# EAGLE design StickIt-Buttons (EAGLE 5.11)
AUTHOR: Dave Vandenbout / XESS Corp.; DIGIKEY#: 742C083472JPCT-ND; MANF#: 742C083472JPTR; MOUSER#: 774-742C083472JP; VERSION#: 2.0
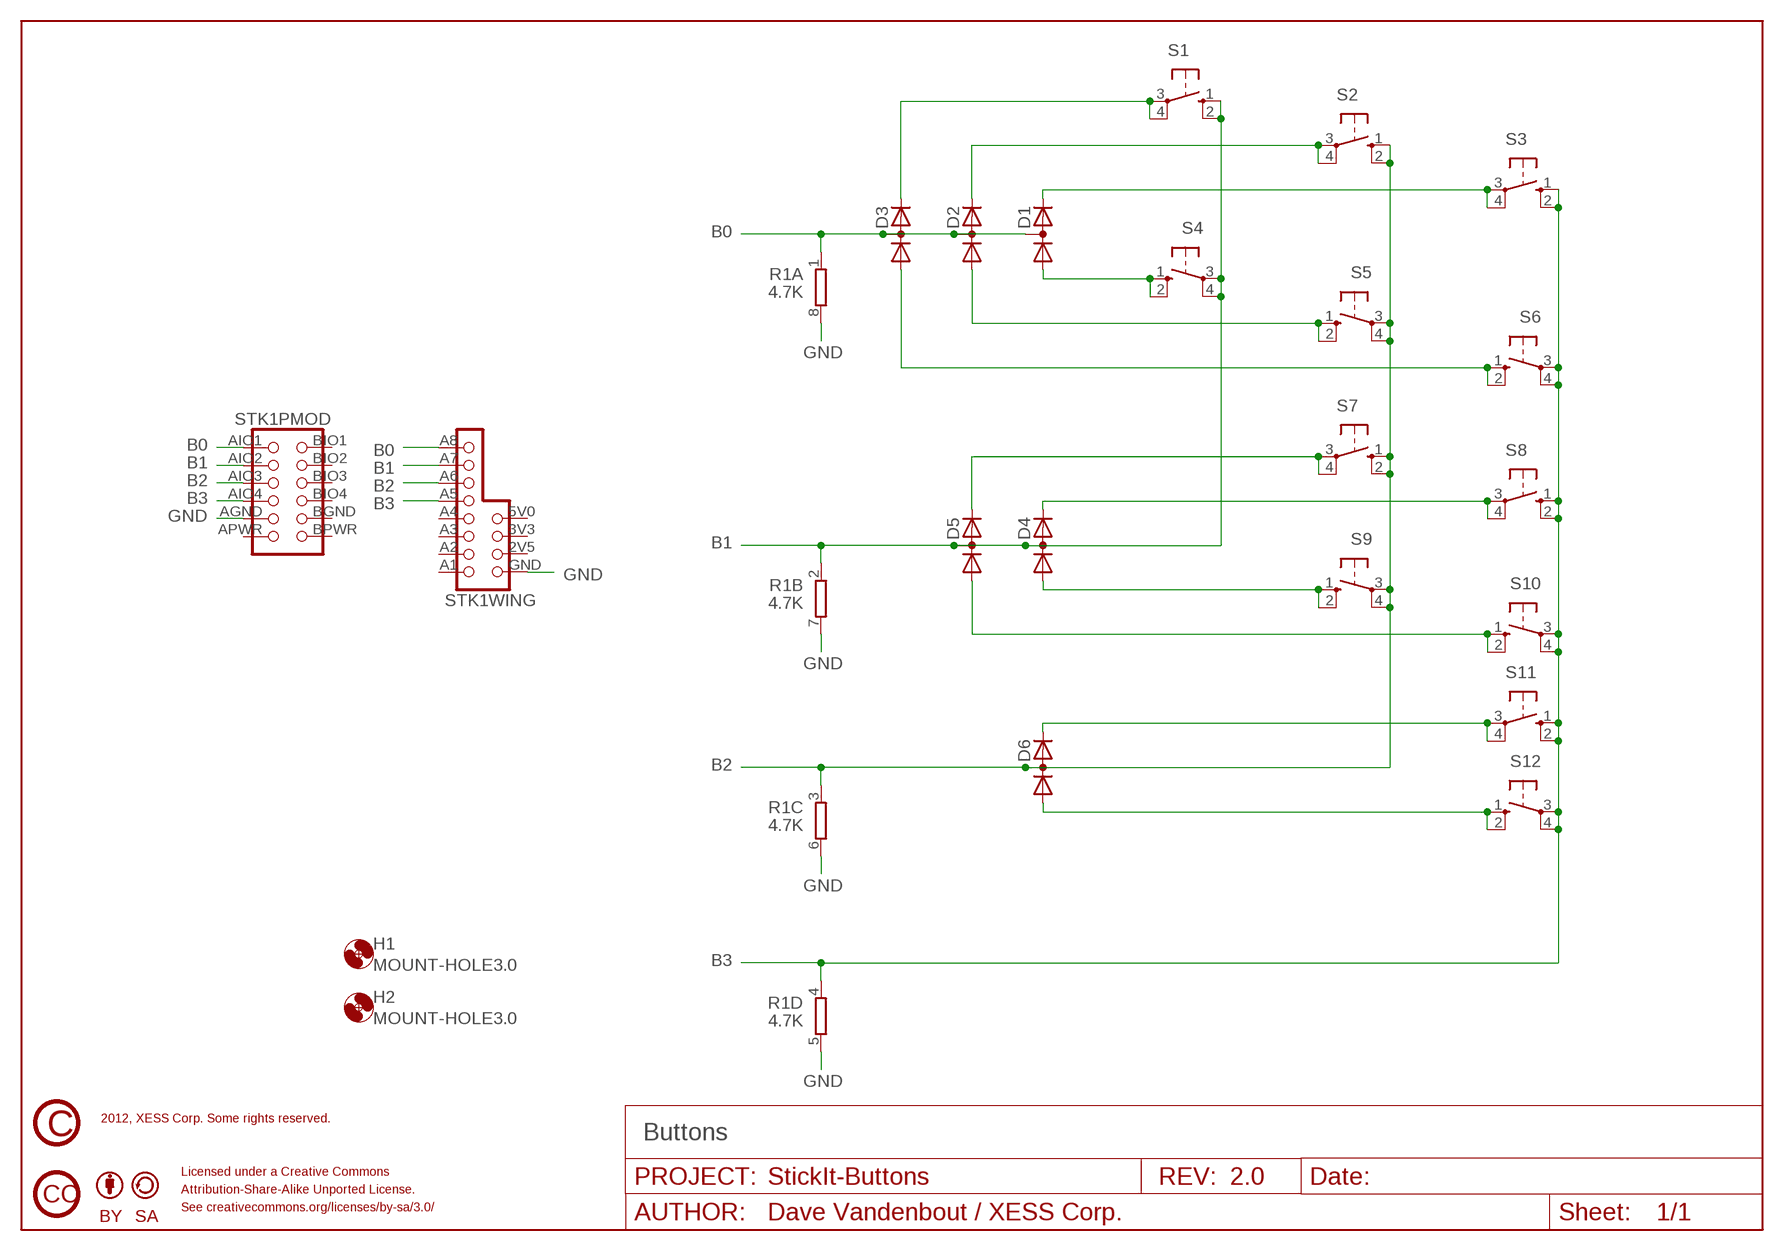
[diagram p0: schematic, sheet 1]

## Parts
D1  DIODE_AC-AC  [SC-70]
D2  DIODE_AC-AC  [SC-70]
D3  DIODE_AC-AC  [SC-70]
D4  DIODE_AC-AC  [SC-70]
D5  DIODE_AC-AC  [SC-70]
D6  DIODE_AC-AC  [SC-70]
H1  MOUNT-HOLE3.0  [3,0]
H2  MOUNT-HOLE3.0  [3,0]
R1  4.7K  RES4742  [742C083]
S1  10-XX  [B3F-10XX]
S2  10-XX  [B3F-10XX]
S3  10-XX  [B3F-10XX]
S4  10-XX  [B3F-10XX]
S5  10-XX  [B3F-10XX]
S6  10-XX  [B3F-10XX]
S7  10-XX  [B3F-10XX]
S8  10-XX  [B3F-10XX]
S9  10-XX  [B3F-10XX]
S10  10-XX  [B3F-10XX]
S11  10-XX  [B3F-10XX]
S12  10-XX  [B3F-10XX]
STK1  STICKIT-HEADER1  [STICKIT-HEADER1]
U$2  CC_CC  [CC_CC]
U$3  CC_BY  [CC_BY]
U$4  CC_SA  [CC_SA]
U$5  CC_COPYRIGHT  [CC_COPYRIGHT]

## Nets
B0: D1.3(AK) D2.3(AK) D3.3(AK) R1.1 STK1.A8(WING:A8) STK1.AIO1(PMOD:AIO1)
B1: D4.3(AK) D5.3(AK) R1.2 S1.1(S) S1.2(S1) S4.3(P) S4.4(P1) STK1.A7(WING:A7) STK1.AIO2(PMOD:AIO2)
B01: D3.2(K) S1.3(P) S1.4(P1)
B2: D6.3(AK) R1.3 S2.1(S) S2.2(S1) S5.3(P) S5.4(P1) S7.1(S) S7.2(S1) S9.3(P) S9.4(P1) STK1.A6(WING:A6) STK1.AIO3(PMOD:AIO3)
B02: D2.2(K) S2.3(P) S2.4(P1)
B3: R1.4 S3.1(S) S3.2(S1) S6.3(P) S6.4(P1) S8.1(S) S8.2(S1) S10.3(P) S10.4(P1) S11.1(S) S11.2(S1) S12.3(P) S12.4(P1) STK1.A5(WING:A5) STK1.AIO4(PMOD:AIO4)
B03: D1.2(K) S3.3(P) S3.4(P1)
B10: D1.1(A) S4.1(S) S4.2(S1)
B12: D5.2(K) S7.3(P) S7.4(P1)
B13: D4.2(K) S8.3(P) S8.4(P1)
B20: D2.1(A) S5.1(S) S5.2(S1)
B21: D4.1(A) S9.1(S) S9.2(S1)
B23: D6.2(K) S11.3(P) S11.4(P1)
B30: D3.1(A) S6.1(S) S6.2(S1)
B31: D5.1(A) S10.1(S) S10.2(S1)
B32: D6.1(A) S12.1(S) S12.2(S1)
GND: R1.5 R1.6 R1.7 R1.8 STK1.AGND(PMOD:AGND) STK1.GND(WING:GND)
Unconnected: STK1.2V5(WING:2V5) STK1.3V3(WING:3V3) STK1.5V0(WING:5V) STK1.A1(WING:A1) STK1.A2(WING:A2) STK1.A3(WING:A3) STK1.A4(WING:A4) STK1.APWR(PMOD:APWR) STK1.BGND(PMOD:BGND) STK1.BIO1(PMOD:BIO1) STK1.BIO2(PMOD:BIO2) STK1.BIO3(PMOD:BIO3) STK1.BIO4(PMOD:BIO4) STK1.BPWR(PMOD:BPWR)

## Notes on the sheet
- 2012, XESS Corp. Some rights reserved.
- Buttons
- Licensed under a Creative Commons
- Attribution-Share-Alike Unported License.
- See creativecommons.org/licenses/by-sa/3.0/

## Library data of the parts
D1-D6 = xess:DIODE_AC-AC: Dual diode protects against positive & negative transients.; DIGIKEY#: BAV99WT1GOSCT-ND; MANF: ON Semiconductor; MANF#: BAV99WT1G; MOUSER#: 863-BAV99WT1G
H1 H2 = holes:MOUNT-HOLE: MOUNTING HOLE with drill center marker
R1 = xess:RES4: Resistor 4-pack Package of four resistors.; DIGIKEY#: 742C083???JPCT-ND; MANF: CTS Resistor Products; MANF#: 742C083???JPTR; MOUSER#: 774-742C083???JP
S1-S12 = xess:10-XX: OMRON SWITCH; DIGIKEY#: SW400-ND; MANF: Omron Electronics; MANF#: B3F-1000; MOUSER#: 653-B3F-1000
STK1 = xess:STICKIT-HEADER: StickIt Header Combined PMOD and Papilio Wing header for use on StickIt add-on boards.
U$2 = xess:CC_CC
U$3 = xess:CC_BY
U$4 = xess:CC_SA
U$5 = xess:CC_COPYRIGHT

## Net classes
1 power: clearance 0.254 mm

## Board
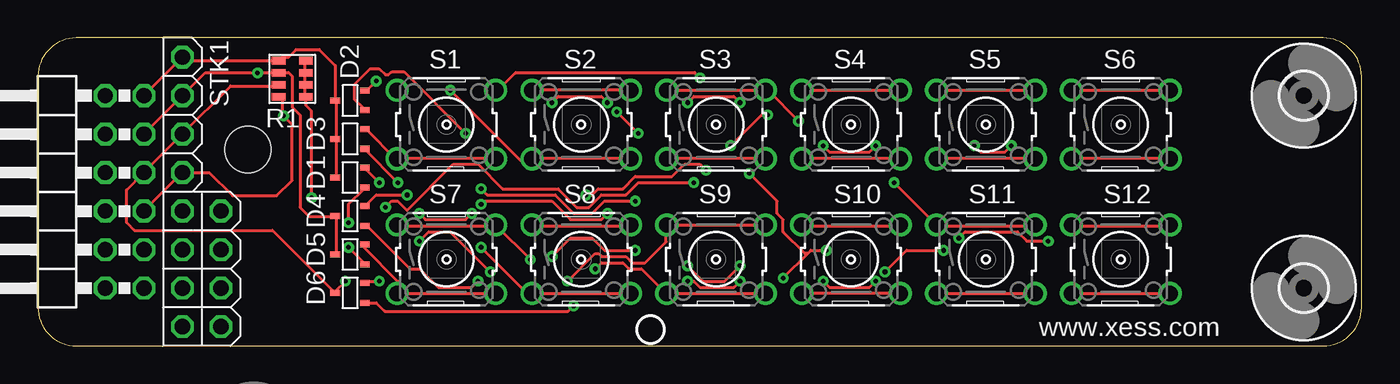
[diagram p1: board, top side]
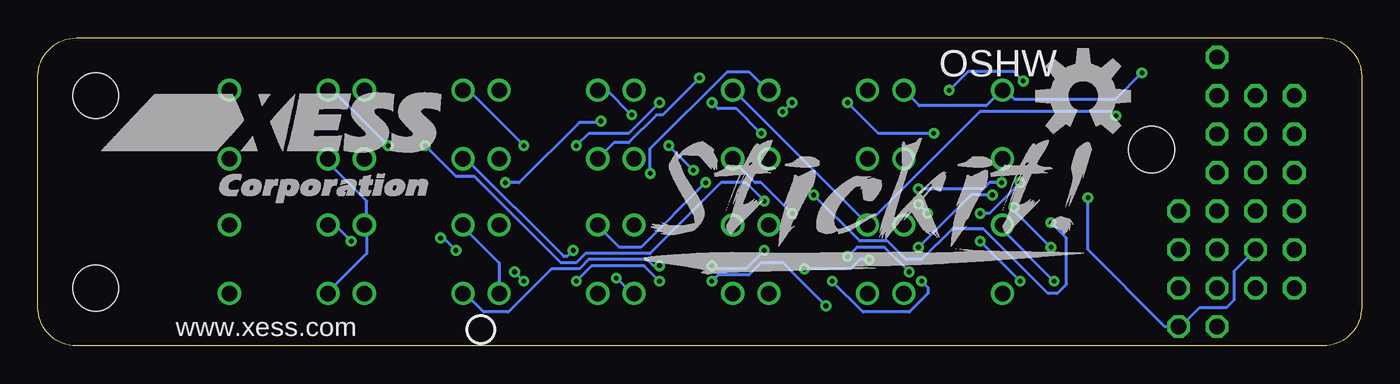
[diagram p2: board, bottom side, seen from below]

Size 87.25 x 20.32 mm. Coordinates in mm from the lower left corner, seen from the top.
Outline: 2.54,0 84.71,0 arc90 87.25,2.54 87.25,17.78 arc90 84.71,20.32 2.54,20.32 arc90 0,17.78 0,2.54 arc90 2.54,0
Copper layers (1*16): Top 0.035mm / dielectric 1.5mm / Bottom 0.035mm
Design rules "ITeadstudio_safe": minimum track width 8mil, minimum drill 12mil, track to track 8mil, track to pad 8mil, pad to pad 8mil, via to via 8mil, smd to smd 0mil, copper to edge 10mil, drill to drill 10mil, minimum pad ring 10mil, minimum via ring 8mil, stop-mask expansion 2mil, vias tented up to drill 100mil, thermal gap 10mil
tRestrict: area 18.7,0 to 87.2,20.3
bRestrict: area 18.7,0 to 87.2,20.3

### Footprints (pad centres in the part's own frame; a part is rotated, then mirrored left to right if it is on the bottom)
SC-70 = smd 0.4 x 0.65: 1 -0.65,-0.975; 2 0.65,-0.975; 3 0,0.975
3,0 = hole 3: 0,0
742C083 = smd 0.5 x 0.9: 1 -0.4,-0.9; 2 0.4,-0.9; 3 1.2,-0.9; 4 2,-0.9; 5 2,0.9; 6 1.2,0.9; 7 0.4,0.9; 8 -0.4,0.9
B3F-10XX = drill 1.016 round: 1 -3.251,2.261; 2 3.251,2.261; 3 -3.251,-2.261; 4 3.251,-2.261
STICKIT-HEADER1 = drill 1 octagon: 2V5 5.08,-15.24; 3V3 5.08,-12.7; 5V0 5.08,-10.16; A1 2.54,-17.78; A2 2.54,-15.24; A3 2.54,-12.7; A4 2.54,-10.16; A5 2.54,-7.62; A6 2.54,-5.08; A7 2.54,-2.54; A8 2.54,0; AGND 0,-12.7; AIO1 0,-2.54; AIO2 0,-5.08; AIO3 0,-7.62; AIO4 0,-10.16; APWR 0,-15.24; BGND -2.54,-12.7; BIO1 -2.54,-2.54; BIO2 -2.54,-5.08; BIO3 -2.54,-7.62; BIO4 -2.54,-10.16; BPWR -2.54,-15.24; GND 5.08,-17.78 | hole 3.048: 6.858,-6.096

### Placement (x,y rotation side)
D1  20.57,11.11 90 top
D2  20.57,16.19 90 top
D3  20.57,13.65 90 top
D4  20.57,8.57 90 top
D5  20.57,6.03 90 top
D6  20.57,3.49 90 top
H1  83.44,3.81 0 top
H2  83.44,16.51 0 top
R1  16.76,18.41 270 top
S1  26.92,14.61 0 top
S2  35.81,14.61 0 top
S3  44.7,14.61 0 top
S4  53.59,14.61 0 top
S5  62.48,14.61 0 top
S6  71.37,14.61 0 top
S7  26.92,5.71 0 top
S8  35.81,5.71 0 top
S9  44.7,5.71 0 top
S10  53.59,5.71 0 top
S11  62.48,5.71 0 top
S12  71.37,5.71 0 top
STK1  6.99,19.05 0 top
U$2  14.22,-14.61 0 top  (outside the outline)
U$3  21.21,-13.34 0 top  (outside the outline)
U$4  26.29,-13.34 0 top  (outside the outline)
U$5  14.22,-5.71 0 top  (outside the outline)

### Tracks (layer width: path | path; a pad name or v marks a point on that pad's centre or on a via)
B0
  Top 0.203: D1.3 19.66,11.18 19.66,13.61 D3.3 19.66,13.82 19.66,16.05 D2.3 | D2.3 19.66,16.26 | D2.3 19.6,18.5 18.54,19.56 17.02,19.56 16.51,19.05 16.1,19.05 R1.1 9.76,18.82 STK1.A8 STK1.AIO1
B1  (via drill 0.3)
  Top 0.203: S4.3 50.34,12.39 56.84,12.39 S4.4 | 19.66,8.53 19.66,6.1 D5.3 | 19.66,8.53 D4.3 | STK1.AIO2 STK1.A7 11.03,18.02 v14.48,18.02 R1.2 15.88,18.03 16.51,18.03 16.76,17.78 16.76,15.75 17.27,15.24 17.27,9.14 17.88,8.53 19.66,8.53 | S1.2 30.33,16.87 31.5,18.03 43.28,18.03 v43.64,17.68
  Bottom 0.203: v43.64,17.68 46.08,15.24 46.48,15.24 48.31,13.41 49.28,13.41 S4.3 | v14.48,18.02 16.24,16.26 22.86,16.26 23.47,16.87 S1.1 23.72,16.87 24.74,15.85 29.16,15.85 S1.2
B01
  Top 0.203: D3.2 21.69,14.22 23.52,12.39 S1.3 23.72,12.39 30.02,12.39 S1.4
B2  (via drill 0.3)
  Top 0.203: v20.27,4.27 19.66,3.66 D6.3 | S7.1 23.72,7.92 30.02,7.92 S7.2 v32.46,5.69 | D6.3 19.46,3.66 | S2.2 S2.1 | S9.4 S9.3 41.4,3.45 39.78,5.08 38.96,5.08 38.56,5.49 37.13,5.49 v36.73,5.08 | S5.3 59.28,12.39 65.58,12.39 S5.4 | 50.75,6.1 50.95,6.3 v51.97,6.3 | v49.12,4.47 50.75,6.1 | v46.89,11.38 48.72,9.55 48.72,8.74 49.12,8.33 49.12,7.52 50.55,6.1 50.75,6.1 | D6.3 15.47,7.62 6.35,7.62 5.84,8.13 5.84,10.29 STK1.AIO3 STK1.A6 12.7,17.14 15.79,17.14 R1.3
  Bottom 0.203: v20.27,4.27 23.72,7.72 23.72,7.92 S7.1 | v49.12,4.47 48.11,3.45 S9.4 | v51.97,6.3 52.38,5.89 52.58,5.89 59.08,12.39 S5.3 | v46.89,11.38 46.89,13.01 41.81,18.09 40.39,18.09 39.17,16.87 S2.2 | v32.46,5.69 33.07,5.69 33.68,5.08 v36.73,5.08
B02  (via drill 0.3)
  Top 0.203: v22.3,17.48 21.69,16.87 D2.2 | v27.18,16.87 31.85,12.19 32.46,12.19 S2.3 32.66,12.39 38.96,12.39 S2.4
  Bottom 0.203: v22.3,17.48 22.91,18.09 25.96,18.09 v27.18,16.87
B3  (via drill 0.3)
  Top 0.203: S10.4 S10.3 | S12.3 S12.4 | S6.4 74.52,12.39 68.22,12.39 S6.3 | S11.2 65.58,7.92 59.28,7.92 S11.1 v56.44,10.77 | S3.1 S3.2 48.11,16.87 v50.14,14.83 | 15.8,16.46 R1.4 16.13,16.15 16.13,15.24 v16.19,15.18 16.76,14.61 16.76,10.92 15.75,9.91 12.83,9.91 11.3,11.43 STK1.A5 STK1.AIO4 | S8.1 32.66,7.92 38.96,7.92 S8.2
  Bottom 0.203: S10.4 56.84,5.49 59.28,7.92 S11.1 | S12.3 68.22,3.45 65.58,6.1 65.58,7.92 S11.2 65.58,8.13 65.58,9.55 68.22,12.19 S6.3 | S3.1 41.4,16.87 32.66,8.13 S8.1 32.46,8.13 25.15,15.44 16.46,15.44 v16.19,15.18 | v56.44,10.77 55.52,10.77 51.56,14.73 50.24,14.73 v50.14,14.83
B03  (via drill 0.3)
  Top 0.203: v22.5,10.77 21.69,11.58 D1.2 | v25.15,8.74 25.55,8.33 28.19,8.33 v28.6,8.74 | v29.21,9.35 29.41,9.55 33.88,9.55 35.1,8.33 37.13,8.33 v37.54,8.74 | S3.4 47.9,12.39 41.6,12.39 S3.3
  Bottom 0.203: v22.5,10.77 24.54,8.74 v25.15,8.74 | v28.6,8.74 v29.21,9.35 | v37.54,8.74 39.57,10.77 39.98,10.77 41.4,12.19 S3.3
B10  (via drill 0.3)
  Top 0.203: v20.47,8.13 20.47,9.35 21.49,10.36 D1.1 | v36.12,9.96 36.52,9.96 36.93,10.36 38.56,10.36 39.37,11.18 41.81,11.18 42.62,11.99 43.64,11.99 v44.04,11.58 | v45.67,13.21 47.7,15.24 v48.11,15.24 | S4.1 S4.2
  Bottom 0.203: v20.47,8.13 19.46,7.11 19.46,4.06 20.07,3.45 20.68,3.45 24.94,7.72 26.98,7.72 29.01,5.69 30.02,5.69 31.24,6.91 33.07,6.91 v36.12,9.96 | v44.04,11.58 v45.67,13.21 | v48.11,15.24 49.73,16.87 S4.1
B12
  Top 0.203: 23.72,3.45 23.72,4.27 21.49,6.5 D5.2 | 23.72,3.45 S7.4 | S7.3 23.72,3.45
B13  (via drill 0.3)
  Top 0.203: v24.33,9.96 22.3,9.96 21.69,9.35 D4.2 | v29.21,6.5 32.26,3.45 S8.3 S8.4
  Bottom 0.203: v24.33,9.96 25.76,9.96 v29.21,6.5
B20  (via drill 0.3)
  Top 0.203: v28.19,14.02 24.13,18.09 23.32,18.09 23.11,17.88 22.91,17.88 22.5,18.29 21.89,18.29 20.88,17.27 20.88,16.26 21.49,15.65 D2.1 | v33.88,16.05 34.29,16.46 37.13,16.46 v37.54,16.05 | v38.15,15.44 v39.57,14.02 | v42.82,16.05 43.23,16.46 45.87,16.46 v46.28,16.05 | v51.77,13.21 52.17,12.8 54.81,12.8 v55.22,13.21 | S5.1 S5.2
  Bottom 0.203: v28.19,14.02 31.85,14.02 v33.88,16.05 | v37.54,16.05 v38.15,15.44 | v39.57,14.02 41.2,15.65 42.42,15.65 v42.82,16.05 | v46.28,16.05 48.31,14.02 50.95,14.02 v51.77,13.21 | v55.22,13.21 58.88,16.87 S5.1
B21  (via drill 0.3)
  Top 0.203: v29.01,4.27 28.6,3.86 26.36,3.86 25.15,5.08 24.54,5.08 21.69,7.92 D4.1 | v34.9,4.27 36.73,6.1 36.93,6.1 37.13,5.89 38.76,5.89 39.17,5.49 40.03,5.49 41.4,6.86 41.4,7.92 S9.1 S9.2
  Bottom 0.203: v29.01,4.27 28.6,3.86 28.6,3.45 29.82,2.23 32.87,2.23 v34.9,4.27
B23  (via drill 0.3)
  Top 0.203: v22.5,4.27 21.69,4.27 D6.2 | v25.15,6.91 25.76,7.52 27.18,7.52 v29.82,4.88 | v33.88,5.89 35.1,7.11 36.52,7.11 37.34,6.3 v39.37,6.3 | v42.82,5.28 43.84,4.27 45.26,4.27 v46.28,5.28 | S11.3 S11.4
  Bottom 0.203: v22.5,4.27 v25.15,6.91 | v29.82,4.88 31.45,6.5 33.27,6.5 v33.88,5.89 | v39.37,6.3 40.59,5.08 42.62,5.08 v42.82,5.28 | v46.28,5.28 46.69,5.28 47.09,5.69 50.95,5.69 51.56,5.08 53.39,5.08 56.24,2.23 57.86,2.23 59.08,3.45 S11.3
B30  (via drill 0.3)
  Top 0.203: v23.72,10.77 21.49,13.01 D3.1 | v29.21,10.36 29.62,9.96 34.09,9.96 35.31,8.74 36.52,8.74 37.34,9.55 v39.37,9.55 | v61.72,13.21 62.13,12.8 63.75,12.8 v64.16,13.21 | S6.1 S6.2
  Bottom 0.203: v23.72,10.77 24.54,10.77 24.94,10.36 v29.21,10.36 | v39.37,9.55 40.59,10.77 42.22,10.77 46.89,6.1 51.16,6.1 51.77,5.49 52.78,5.49 58.47,11.18 59.69,11.18 v61.72,13.21 | v64.16,13.21 67.82,16.87 S6.1
B31  (via drill 0.3)
  Top 0.203: v20.47,6.5 21.49,5.49 D5.1 | v22.91,9.14 23.32,9.55 23.72,9.55 24.33,8.94 27.38,11.99 29.01,11.99 30.63,10.36 34.29,10.36 35.51,9.14 36.32,9.14 37.13,9.96 38.76,9.96 39.57,10.77 v43.23,10.77 | S10.2 56.84,7.92 50.34,7.92 S10.1
  Bottom 0.203: v20.47,6.5 22.91,8.94 v22.91,9.14 | v43.23,10.77 47.5,6.5 48.92,6.5 50.34,7.92 S10.1
B32  (via drill 0.3)
  Top 0.203: v42.82,4.27 43.23,4.27 43.64,3.86 45.87,3.86 v46.28,4.27 | v51.77,4.27 52.17,3.86 54.81,3.86 v55.22,4.27 | v55.83,4.88 57.25,6.3 v59.69,6.3 | v60.71,7.11 61.11,7.52 64.57,7.52 65.18,6.91 v66.6,6.91 | D6.1 21.69,2.85 22.3,2.85 22.86,2.29 34.95,2.29 v35.31,2.64 | S12.2 74.52,7.92 68.22,7.92 S12.1
  Bottom 0.203: v35.31,2.64 38.15,5.49 39.57,5.49 40.39,4.67 42.42,4.67 v42.82,4.27 | v46.28,4.27 47.3,5.28 50.75,5.28 v51.77,4.27 | v55.22,4.27 v55.83,4.88 | v59.69,6.3 60.5,7.11 v60.71,7.11 | v66.6,6.91 67.82,8.13 68.02,8.13 S12.1
GND  (via drill 0.3)
  Top 0.203: R1.8 17.63,18.69 17.63,18.09 R1.7 17.63,17.88 17.63,17.27 R1.6 17.63,17.07 17.63,16.46 R1.5 17.66,15.86 18.03,15.49 v18.03,9.78
  Bottom 0.203: v18.03,9.78 18.03,6.35 12.95,1.27 STK1.GND 11.94,1.27 10.67,2.54 8.89,2.54 8.38,3.05 8.38,4.95 STK1.AGND

### Text on the board
tPlace: www.xess.com
bPlace: OSHW | www.xess.com
tDocu: 2012, XESS Corp. Some rights reserved. | Licensed under a Creative Commons | Attribution-Share-Alike Unported License. | See creativecommons.org/licenses/by-sa/3.0/